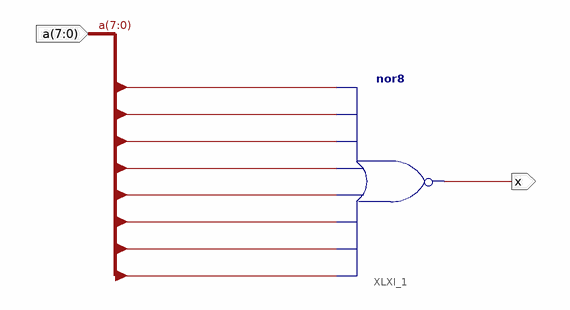
[diagram p0: schematic sheet 1]
// Xilinx ISE schematic lzero.sch (aspartan6) as structural Verilog: 1 symbols, 2 ports
module lzero (
  input  [7:0] a,
  output x
);

  nor XLXI_1 (x, a[7], a[6], a[5], a[4], a[3], a[2], a[1], a[0]);
endmodule
